# Altium schematic sheet MainSCH.SchDoc
size A4; SheetNumber: 1; SheetTotal: 5
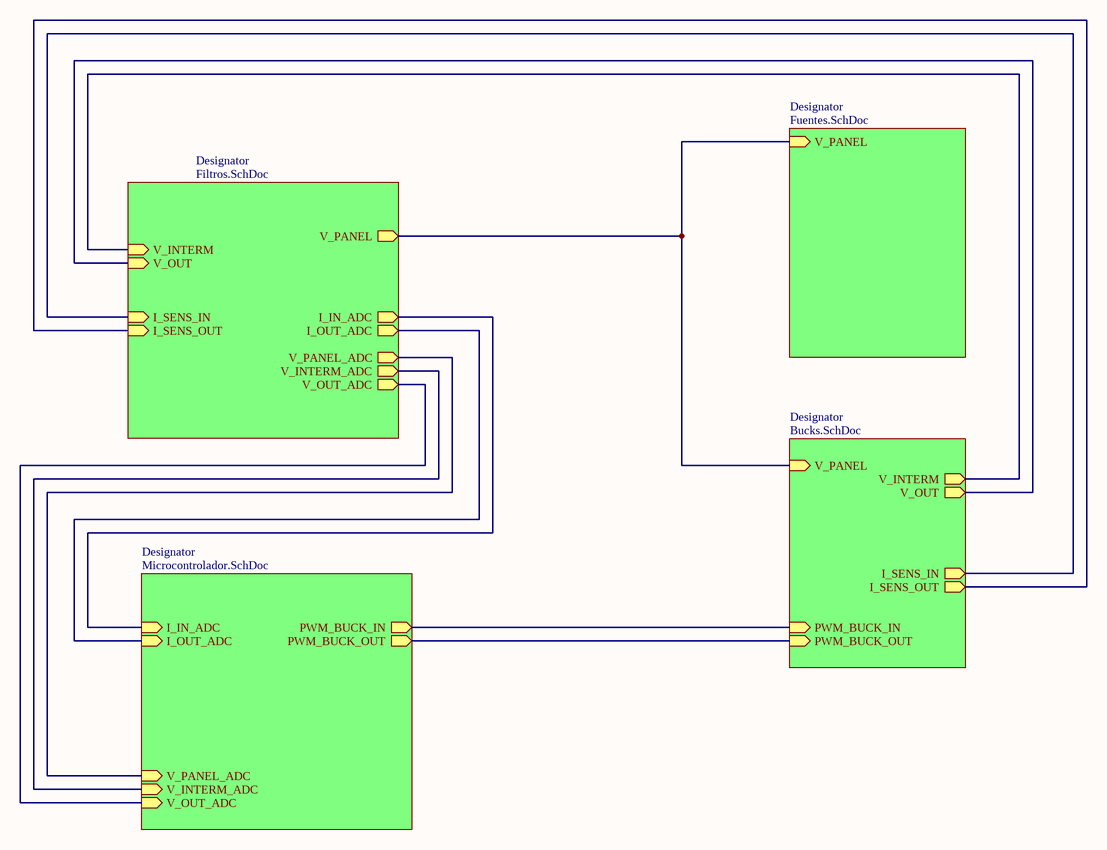
[diagram p0: MainSCH.SchDoc]

## Sub-sheets
Designator = Bucks.SchDoc: V_PANEL (in), V_INTERM (out), PWM_BUCK_OUT (in), PWM_BUCK_IN (in), V_OUT (out), I_SENS_IN (out), I_SENS_OUT (out)
Designator = Filtros.SchDoc: I_SENS_IN (in), I_SENS_OUT (in), V_INTERM (in), V_OUT (in), V_PANEL (out), I_IN_ADC (out), I_OUT_ADC (out), V_PANEL_ADC (out), V_INTERM_ADC (out), V_OUT_ADC (out)
Designator = Fuentes.SchDoc: V_PANEL (in)
Designator = Microcontrolador.SchDoc: I_IN_ADC (in), I_OUT_ADC (in), V_PANEL_ADC (in), V_INTERM_ADC (in), PWM_BUCK_IN (out), PWM_BUCK_OUT (out), V_OUT_ADC (in)

## Nets
(unnamed): sheet Designator/V_PANEL, sheet Designator/V_PANEL, sheet Designator/V_PANEL
(unnamed): sheet Designator/V_INTERM, sheet Designator/V_INTERM
(unnamed): sheet Designator/PWM_BUCK_OUT, sheet Designator/PWM_BUCK_OUT
(unnamed): sheet Designator/PWM_BUCK_IN, sheet Designator/PWM_BUCK_IN
(unnamed): sheet Designator/V_OUT, sheet Designator/V_OUT
(unnamed): sheet Designator/I_SENS_IN, sheet Designator/I_SENS_IN
(unnamed): sheet Designator/I_SENS_OUT, sheet Designator/I_SENS_OUT
(unnamed): sheet Designator/I_IN_ADC, sheet Designator/I_IN_ADC
(unnamed): sheet Designator/I_OUT_ADC, sheet Designator/I_OUT_ADC
(unnamed): sheet Designator/V_PANEL_ADC, sheet Designator/V_PANEL_ADC
(unnamed): sheet Designator/V_INTERM_ADC, sheet Designator/V_INTERM_ADC
(unnamed): sheet Designator/V_OUT_ADC, sheet Designator/V_OUT_ADC